# EAGLE schematic Schematic_IR _1.1 (EAGLE 9.6.2)
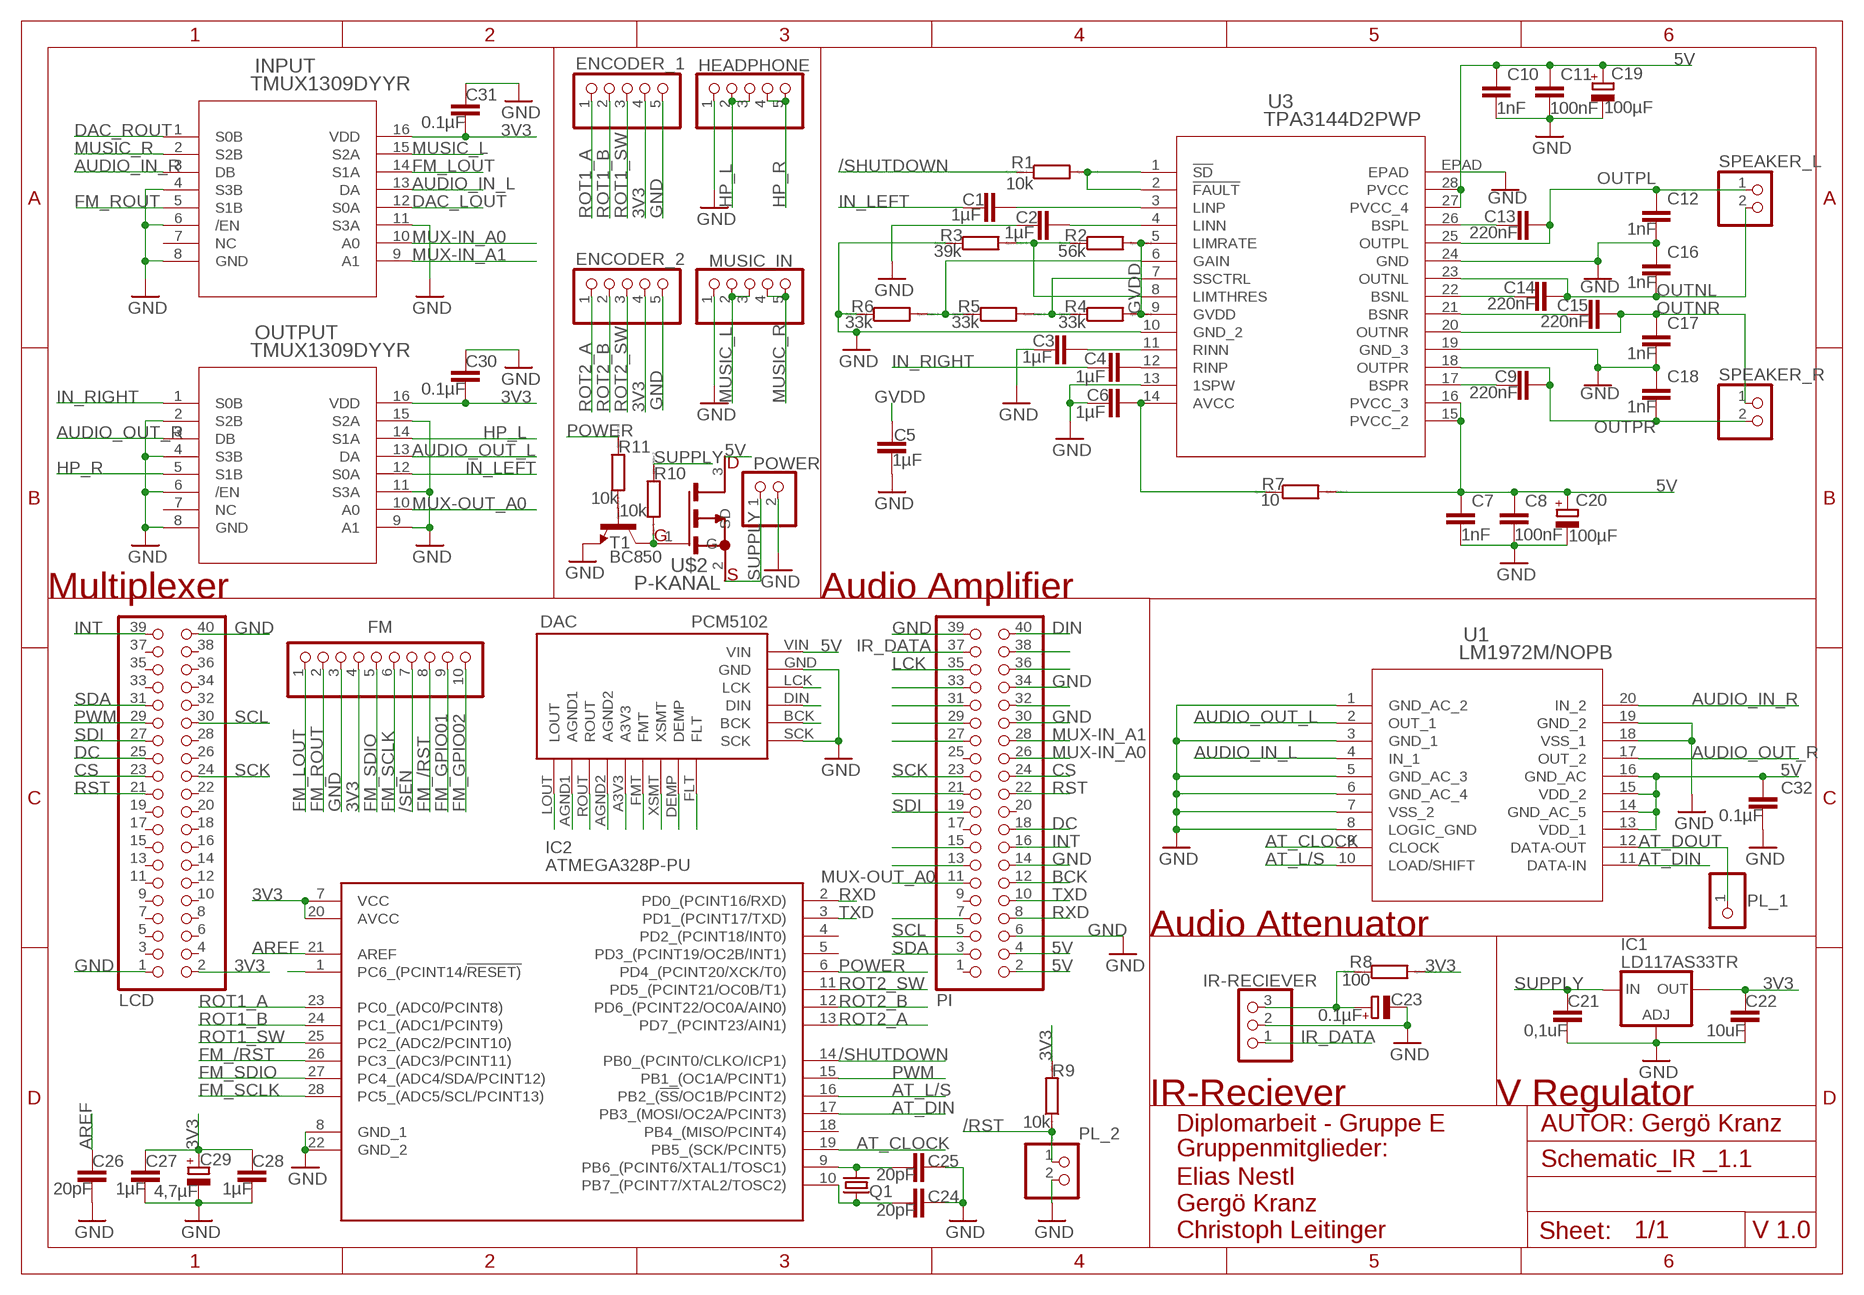
[diagram p0: schematic, sheet 1]
FRAME2 (A4L-LOC): AUTOR: AUTOR: Gergö Kranz; GRUPPEN: Gruppenmitglieder:; GRUPPENNAME: Diplomarbeit - Gruppe E; MITGLIED_1: Elias Nestl; MITGLIED_2: Christoph Leitinger; MITGLIED_3: Gergö Kranz; REVISION: V 1.0

## Parts
C1  1µF  C-EUC0603K  [C0603K]
C2  1µF  C-EUC0603K  [C0603K]
C3  1µF  C-EUC0603K  [C0603K]
C4  1µF  C-EUC0603K  [C0603K]
C5  1µF  C-EUC0603K  [C0603K]
C6  1µF  C-EUC0603K  [C0603K]
C7  1nF  C-EUC0603K  [C0603K]
C8  100nF  C-EUC0603K  [C0603K]
C9  220nF  C-EUC0603K  [C0603K]
C10  1nF  C-EUC0603K  [C0603K]
C11  100nF  C-EUC0603K  [C0603K]
C12  1nF  C-EUC0603K  [C0603K]
C13  220nF  C-EUC0603K  [C0603K]
C14  220nF  C-EUC0603K  [C0603K]
C15  220nF  C-EUC0603K  [C0603K]
C16  1nF  C-EUC0603K  [C0603K]
C17  1nF  C-EUC0603K  [C0603K]
C18  1nF  C-EUC0603K  [C0603K]
C19  100µF  CPOL-EUSMCB  [SMC_B]
C20  100µF  CPOL-EUSMCB  [SMC_B]
C21  0,1uF  C-EUC0603K  [C0603K]
C22  10uF  C-EUC0603K  [C0603K]
C23  0.1µF  CPOL-EUSMCB  [SMC_B]
C24  20pF  C-EUC0603K  [C0603K]
C25  20pF  C-EUC0603K  [C0603K]
C26  20pF  C-EUC0603K  [C0603K]
C27  1µF  C-EUC0603K  [C0603K]
C28  1µF  C-EUC0603K  [C0603K]
C29  4,7µF  CPOL-EUSMCB  [SMC_B]
C30  0.1µF  C-EUC0603K  [C0603K]
C31  0.1µF  C-EUC0603K  [C0603K]
C32  0.1µF  C-EUC0603K  [C0603K]
DAC  PCM5102  [PCM5102]
ENCODER_1  PINHD-1X5  [1X05]
ENCODER_2  PINHD-1X5  [1X05]
FM  PINHD-1X10_2.54  [1X10]
HEADPHONE  PINHD-1X5_2.54  [1X05]
IC1  LD117AS33TR  [SOT223]
IC2  ATMEGA328P-PU  [DIP794W53P254L3467H457Q28N]
INPUT  TMUX1309DYYR  [SOIC_309DYYR_TEX]
IR-RECIEVER  PINHD-1X3_2.54  [1X03]
LCD  PINHD-2X20  [2X20]
MUSIC_IN  PINHD-1X5_2.54  [1X05]
OUTPUT  TMUX1309DYYR  [SOIC_309DYYR_TEX]
PI  PINHD-2X20  [2X20]
PL_1  PINHD-1X1_2.00  [1X01M]
PL_2  PINHD-1X2_2.00  [1X02M]
POWER  PINHD-1X2_2.54  [1X02]
Q1  KX-KS  [11.4X4.5]
R1  10k  RR0603  [R0603]
R2  56k  RR0603  [R0603]
R3  39k  RR0603  [R0603]
R4  33k  RR0603  [R0603]
R5  33k  RR0603  [R0603]
R6  33k  RR0603  [R0603]
R7  10  RR0603  [R0603]
R8  100  RR0603  [R0603]
R9  10k  RR0603  [R0603]
R10  10k  RR0603  [R0603]
R11  10k  RR0603  [R0603]
SPEAKER_L  PINHD-1X2_2.54  [1X02]
SPEAKER_R  PINHD-1X2_2.54  [1X02]
T1  BC850  [SOT23]
U1  LM1972M/NOPB  [M20B_TEX]
U3  TPA3144D2PWP  [PWP28_2P4X3.4_TEX]
U$2  P-KANAL  [SOT23]

## Nets
3V3: C22.2 C27.1 C28.1 C29.+ C30.2 C31.2 ENCODER_1.4 ENCODER_2.4 FM.4 IC1.4(OUT) IC2.7(VCC) IC2.20(AVCC) INPUT.16(VDD) LCD.2 OUTPUT.16(VDD) R8.2 R9.2
5V: C7.1 C8.1 C10.1 C11.1 C19.+ C20.+ C32.1 DAC.VIN PI.2 PI.4 R7.2 U1.13(VDD_1) U1.14(GND_AC_5) U1.15(VDD_2) U1.16(GND_AC) U3.15(PVCC_2) U3.16(PVCC_3) U3.27(PVCC_4) U3.28(PVCC) U$2.3(D)
/RST: IC2.1(PC6_(PCINT14/!RESET)) PL_2.1 R9.1
/SEN: FM.7
/SHUTDOWN: IC2.14(PB0_(PCINT0/CLKO/ICP1)) R1.1
AREF: C26.1 IC2.21(AREF)
AT_CLOCK: IC2.19(PB5_(SCK/PCINT5)) U1.9(CLOCK)
AT_DIN: IC2.17(PB3_(MOSI/OC2A/PCINT3)) U1.11(DATA-IN)
AT_DOUT: PL_1.1 U1.12(DATA-OUT)
AT_L/S: IC2.16(PB2_(!SS!/OC1B/PCINT2)) U1.10(LOAD/SHIFT)
AUDIO_IN_L: INPUT.13(DA) U1.4(IN_1)
AUDIO_IN_R: INPUT.3(DB) U1.20(IN_2)
AUDIO_OUT_L: OUTPUT.13(DA) U1.2(OUT_1)
AUDIO_OUT_R: OUTPUT.3(DB) U1.17(OUT_2)
BCK: DAC.BCK PI.12
CS: LCD.23 PI.24
DAC_LOUT: DAC.LOUT INPUT.12(S0A)
DAC_ROUT: DAC.ROUT INPUT.1(S0B)
DC: LCD.25 PI.18
DIN: DAC.DIN PI.40
FM_/RST: FM.8 IC2.26(PC3_(ADC3/PCINT11))
FM_GPIO01: FM.9
FM_GPIO02: FM.10
FM_LOUT: FM.1 INPUT.14(S1A)
FM_ROUT: FM.2 INPUT.5(S1B)
FM_SCLK: FM.6 IC2.28(PC5_(ADC5/SCL/PCINT13))
FM_SDIO: FM.5 IC2.27(PC4_(ADC4/SDA/PCINT12))
GND: C2.1 C3.1 C5.2 C6.1 C7.2 C8.2 C10.2 C11.2 C12.2 C16.1 C17.2 C18.1 C19.- C20.- C21.1 C22.1 C23.- C24.1 C25.1 C26.2 C27.2 C28.2 C29.- C30.1 C31.1 C32.2 DAC.GND DAC.SCK ENCODER_1.5 ENCODER_2.5 FM.3 HEADPHONE.1 IC1.1(ADJ) IC2.8(GND_1) IC2.22(GND_2) INPUT.4(S3B) INPUT.6(/EN) INPUT.8(GND) INPUT.11(S3A) IR-RECIEVER.2 LCD.1 LCD.40 MUSIC_IN.1 OUTPUT.2(S2B) OUTPUT.4(S3B) OUTPUT.6(/EN) OUTPUT.8(GND) OUTPUT.9(A1) OUTPUT.11(S3A) OUTPUT.15(S2A) PI.6 PI.14 PI.30 PI.34 PI.39 PL_2.2 POWER.2 R3.1 R6.1 T1.2(E) U1.1(GND_AC_2) U1.3(GND_1) U1.5(GND_AC_3) U1.6(GND_AC_4) U1.7(VSS_2) U1.8(LOGIC_GND) U1.18(VSS_1) U1.19(GND_2) U3.10(GND_2) U3.13(1SPW) U3.19(GND_3) U3.24(GND) U3.EPAD
GVDD: C5.1 R2.2 R4.2 U3.5(LIMRATE) U3.9(GVDD)
HP_L: HEADPHONE.2 HEADPHONE.3 OUTPUT.14(S1A)
HP_R: HEADPHONE.4 HEADPHONE.5 OUTPUT.5(S1B)
IN_LEFT: C1.1 OUTPUT.12(S0A)
IN_RIGHT: C4.1 OUTPUT.1(S0B)
INT: LCD.39 PI.16
IR_DATA: IR-RECIEVER.1 PI.37
LCK: DAC.LCK PI.35
MUSIC_L: INPUT.15(S2A) MUSIC_IN.2 MUSIC_IN.3
MUSIC_R: INPUT.2(S2B) MUSIC_IN.4 MUSIC_IN.5
MUX-IN_A0: INPUT.10(A0) PI.26
MUX-IN_A1: INPUT.9(A1) PI.28
MUX-OUT_A0: OUTPUT.10(A0) PI.11
N$1: R1.2 U3.1(!SD) U3.2(!FAULT)
N$2: C4.2 U3.12(RINP)
N$3: PI.7
N$4: R11.2 T1.1(B)
N$5: PI.13
N$6: PI.15
N$7: R4.1 R5.2 U3.7(SSCTRL)
N$8: PI.21
N$9: R2.1 R3.2 U3.8(LIMTHRES)
N$10: PI.27
N$11: PI.29
N$12: PI.31
N$13: PI.33
N$14: R5.1 R6.2 U3.6(GAIN)
N$16: PI.36
N$17: PI.38
N$18: C6.2 R7.1 U3.14(AVCC)
N$19: R10.1 T1.3(C) U$2.1(G)
N$20: C24.2 IC2.10(PB7_(PCINT7/XTAL2/TOSC2)) Q1.1
N$21: C25.2 IC2.9(PB6_(PCINT6/XTAL1/TOSC1)) Q1.2
N$22: PI.32
N$25: C1.2 U3.3(LINP)
N$28: C2.2 U3.4(LINN)
N$29: C13.1 U3.26(BSPL)
N$30: C23.+ IR-RECIEVER.3 R8.1
N$31: DAC.FLT
N$32: C3.2 U3.11(RINN)
N$33: C14.1 U3.22(BSNL)
N$34: C15.1 U3.21(BSNR)
N$35: DAC.DEMP
N$36: C9.1 U3.17(BSPR)
N$38: DAC.XSMT
N$39: DAC.FMT
N$40: DAC.A3V3
N$41: DAC.AGND2
N$46: DAC.AGND1
OUTNL: C14.2 C16.2 SPEAKER_L.2 U3.23(OUTNL)
OUTNR: C15.2 C17.1 SPEAKER_R.1 U3.20(OUTNR)
OUTPL: C12.1 C13.2 SPEAKER_L.1 U3.25(OUTPL)
OUTPR: C9.2 C18.2 SPEAKER_R.2 U3.18(OUTPR)
POWER: IC2.6(PD4_(PCINT20/XCK/T0)) R11.1
PWM: IC2.15(PB1_(OC1A/PCINT1)) LCD.29
ROT1_A: ENCODER_1.1 IC2.23(PC0_(ADC0/PCINT8))
ROT1_B: ENCODER_1.2 IC2.24(PC1_(ADC1/PCINT9))
ROT1_SW: ENCODER_1.3 IC2.25(PC2_(ADC2/PCINT10))
ROT2_A: ENCODER_2.1 IC2.13(PD7_(PCINT23/AIN1))
ROT2_B: ENCODER_2.2 IC2.12(PD6_(PCINT22/OC0A/AIN0))
ROT2_SW: ENCODER_2.3 IC2.11(PD5_(PCINT21/OC0B/T1))
RST: LCD.21 PI.22
RXD: IC2.2(PD0_(PCINT16/RXD)) PI.8
SCK: LCD.24 PI.23
SCL: LCD.30 PI.5
SDA: LCD.31 PI.3
SDI: LCD.27 PI.19
SUPPLY: C21.2 IC1.3(IN) POWER.1 R10.2 U$2.2(S)
TXD: IC2.3(PD1_(PCINT17/TXD)) PI.10
Unconnected: IC2.4(PD2_(PCINT18/INT0)) IC2.5(PD3_(PCINT19/OC2B/INT1)) IC2.18(PB4_(MISO/PCINT4)) INPUT.7(NC) LCD.3 LCD.4 LCD.5 LCD.6 LCD.7 LCD.8 LCD.9 LCD.10 LCD.11 LCD.12 LCD.13 LCD.14 LCD.15 LCD.16 LCD.17 LCD.18 LCD.19 LCD.20 LCD.22 LCD.26 LCD.28 LCD.32 LCD.33 LCD.34 LCD.35 LCD.36 LCD.37 LCD.38 OUTPUT.7(NC) PI.1 PI.9 PI.17 PI.20 PI.25

## Notes on the sheet
- Multiplexer | Audio Amplifier
- Audio Attenuator
- IR-Reciever | V Regulator

## Library data of the parts
C1-C18 C21 C22 C24-C28 C30-C32 = rcl:C-EU: CAPACITOR, European symbol; SPICEPREFIX: C
C19 C20 C23 C29 = rcl:CPOL-EU: POLARIZED CAPACITOR, European symbol; SPICEPREFIX: C
DAC = Fancy_InternetRadio:PCM5102
ENCODER_1 ENCODER_2 = pinhead:PINHD-1X5: PIN HEADER
FM = pinhead-ext:PINHD-1X10: PIN HEADER
HEADPHONE MUSIC_IN = pinhead-ext:PINHD-1X5: PIN HEADER
IC1 = v-reg:LD117A?*: Low drop fixed and adjustable positive voltage regulators 1 A Source: http://www.st.com/stonline/products/literature/ds/7194/ld1117axx.pdf
IC2 = Fancy_InternetRadio:ATMEGA328P-PU: MICROCHIP - ATMEGA328P-PU. - MICROCONTROLLER MCU, 8 BIT, ATMEGA, 20MHZ, DIP-28 Source: Datasheet <http://ww1.microchip.com/downloads/en/DeviceDoc/Atmel-42735-8-bit-AVR-Microcontroller-ATmega328-328P_Datasheet.pdf>; DESCRIPTION: MICROCHIP - ATMEGA328P-PU. - MICROCONTROLLER MCU, 8 BIT, ATMEGA, 20MHZ, DIP-28; HEIGHT: 4.572mm; MANUFACTURER_NAME: Microchip; MANUFACTURER_PART_NUMBER: ATMEGA328P-PU; MOUSER_PART_NUMBER: 556-ATMEGA328P-PU; MOUSER_PRICE-STOCK: https://www.mouser.co.uk/ProductDetail/Microchip-Technology-Atmel/ATMEGA328P-PU/?qs=K8BHR703ZXguOQv3sKbWcg%3D%3D
INPUT OUTPUT = Fancy_InternetRadio:TMUX1309DYYR; BUILT_BY: EMA_Matt; COPYRIGHT: Copyright (C) 2018 Accelerated Designs. All rights reserved; DATASHEET: https://www.ti.com/lit/ds/symlink/tmux1309.pdf?ts=1598032150860&ref_url=https%253A%252F%252Fwww.ti.com%252Fsitesearch%252Fdocs%252Funiversalsearch.tsp%253FsearchTerm%253DTMUX1309DYYR; MANUFACTURER_PART_NUMBER: TMUX1309DYYR; SOURCELIBRARY: TI_2020-08-21; VENDOR: Texas Instruments
IR-RECIEVER = pinhead-ext:PINHD-1X3: PIN HEADER
LCD PI = pinhead:PINHD-2X20: PIN HEADER
PL_1 = pinhead-ext:PINHD-1X1: PIN HEADER
PL_2 POWER SPEAKER_L SPEAKER_R = pinhead-ext:PINHD-1X2: PIN HEADER
Q1 = crystal-geyer_V1_0:KX: Quartz Crystals (MHz) SMD: KX - Serie Model Size l/w/h [mm] Frequency Range Frequency Stability Temp. Range [°C] Load Capacitance AECQ 200 availabel Datasheet KX-4 KX-5 KX-6 KX-7 KX-9A KX-9B KX-12A KX-12B KX-13 KX-20 KX-K KX-KS 1.6/1.2/0.3 2.0/1.6/0.45 2.5/2.0/0.55 3.2/2.5/0.8 5.0/3.2/1.0 5.0/3.2/1.1 6.0/3.5/1.1 6.0/3.5/1.0 7.0/5.0 /1.3 11.6/5.5/1.6 12.3/4.5/4.2 12.3/4.5/3.2 24.0 ~ 80.0 MHz 16.0 ~ 80.0 MHz 12.0 ~ 80.0 MHz 8.0 ~ 60.0 MHz 7,68 ~ 300,0 MHz 8,0 ~ 50,0 MHz 8,0 ~ 150,0 MHz 8,0 ~ 50,0 MHz 6,0 ~ 160,0 MHz 3,579 ~ 25,0 MHz 3,579 ~ 70,0 MHz 3,579 ~ 70,0 MHz ±10 … ±50ppm ±10 … ±50ppm ±10 … ±50ppm ±10 … ±50ppm ±10 … ±50ppm ±10 … ±50ppm ±10 … ±50ppm ±10 … ±50ppm ±10 … ±50ppm ±50ppm ±10 … ±50ppm ±10 … ±50ppm (*) -40°C …+85°C (*) -40°C …+125°C (*) -40°C …+125°C (*) -40°C …+125°C (*) -40°C …+105°C (*) -40°C …+105°C (*) -40°C …+125°C (*) -40°C …+105°C (*) -40°C …+105°C (*) -40°C …+105°C (*) -40°C …+85°C (*) -40°C …+85°C 8, 8…16 8, 8…16 10, 8…16 12, 7…20 16, 10…20 16, 10…20 16, 10…20 16, 12…20 16, 12…20 16, 12…20 16, 12…30 16, 12…30 - yes yes yes - - - - - - - - KX-4.pdf <http://www.geyer-electronic.de/uploads/tx_userartikelfrequenz/GEYER-KX-4.pdf> KX-5.pdf <http://www.geyer-electronic.de/uploads/tx_userartikelfrequenz/GEYER-KX-5.pdf> KX-6.pdf <http://www.geyer-electronic.de/uploads/tx_userartikelfrequenz/GEYER-KX-6.pdf> KX-7.pdf <http://www.geyer-electronic.de/uploads/tx_userartikelfrequenz/GEYER-KX-7.pdf> KX-9A.pdf <http://www.geyer-electronic.de/uploads/tx_userartikelfrequenz/GEYER-KX-9A.pdf> KX-9B.pdf <http://www.geyer-electronic.de/uploads/tx_userartikelfrequenz/GEYER-KX-9B.pdf> KX-12A.pdf <http://www.geyer-electronic.de/uploads/tx_userartikelfrequenz/GEYER-KX-12A.pdf> KX-12B.pdf <http://www.geyer-electronic.de/uploads/tx_userartikelfrequenz/GEYER-KX-12B.pdf> KX-13.pdf <http://www.geyer-electronic.de/uploads/tx_userartikelfrequenz/GEYER-KX-13.pdf> KX-20.pdf <http://www.geyer-electronic.de/uploads/tx_userartikelfrequenz/GEYER-KX-20.pdf> KX-K.pdf <http://www.geyer-electronic.de/uploads/tx_userartikelfrequenz/GEYER-KX-K.pdf> KX-KS.pdf <http://www.geyer-electronic.de/uploads/tx_userartikelfrequenz/GEYER-KX-KS.pdf> <http://www.geyer-electronic.de/fileadmin/template/img/logo-geyer-electronic.png> Details see: http://www.geyer-electronic.de/Frequenz-Produkte.9.0.html Created 2016-06-07, Hans Locher 2016 (C) Geyer Quartz Technology KX4,KX5,KX6,KX7,KX9A,KX9B,KX12A,KX12B,KX13,KX20,KXK,KXKS;1612;2016;2520;3225;5032;6035;7050;11655;12345;1,6x1,2;2,0x1,6;2,5x2,0;3,2x2,5;5,0x3,2;6,0x3,5;7,0x5,0;11,6x5,5;12,3x4,5;12,3x4,5;1.6x1.2;2.0x1.6;2.5x2.0;3.2x2.5;5.0x3.2;6.0x3.5;7.0x5.0;11.6x5.5;12.3x4.5;12.3x4.5;
R1-R11 = eagle-ltspice:R: RESISTOR, European symbol; SPICEMODEL: NONE; SPICEPREFIX: R
T1 = transistor-neu-to92:BC850: NPN TRANSISTOR
U1 = Fancy_InternetRadio:LM1972M/NOPB; BUILT_BY: EMA_UL_Team; MANUFACTURER_PART_NUMBER: LM1972M/NOPB; SOURCELIBRARY: National_2014-06-20; VENDOR: Texas Instruments
U3 = Fancy_InternetRadio:TPA3144D2PWP; BUILT_BY: EMA_Molly; COPYRIGHT: Copyright (C) 2018 Accelerated Designs. All rights reserved; MANUFACTURER_PART_NUMBER: TPA3144D2PWP; SOURCELIBRARY: TI_2019-05-11; VENDOR: Texas Instruments
U$2 = Fancy_InternetRadio:P-KANAL